# EAGLE design sound (EAGLE 7.2.0)
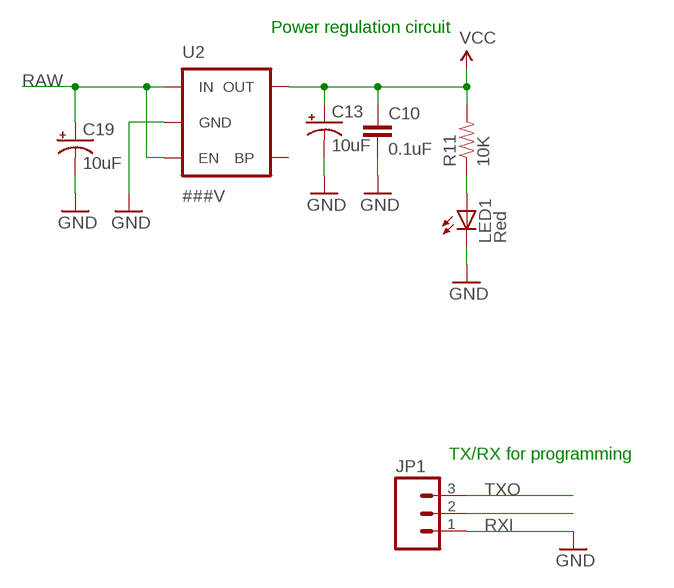
[diagram p0: schematic, sheet 1, part 1 of 2]
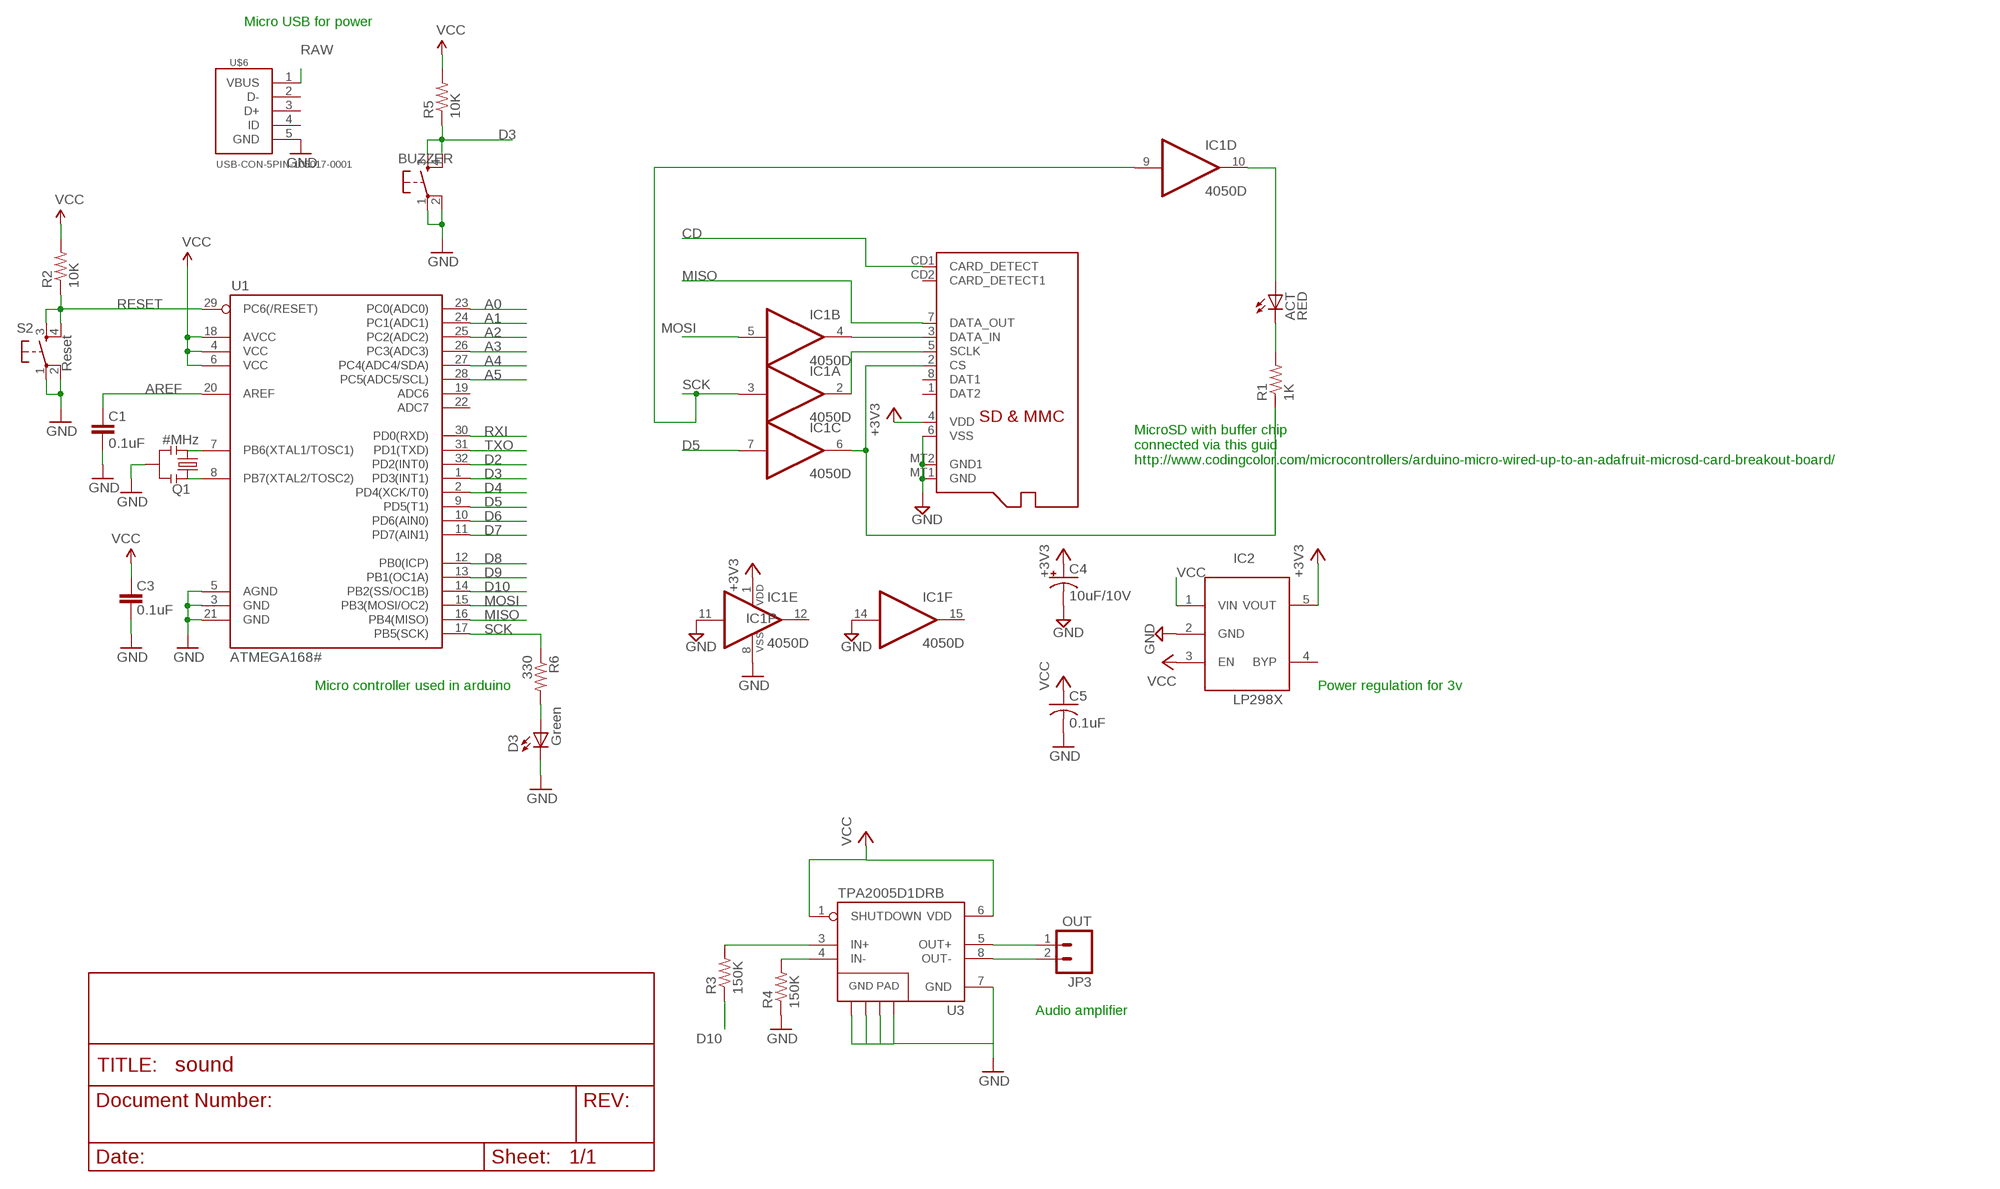
[diagram p1: schematic, sheet 1, part 2 of 2]

## Parts
ACT  RED  LEDCHIP-LED0805  [CHIP-LED0805]
BUZZER  Reset  TAC_SWITCHSND  [TACTILE_SWITCH_SMD]
C1  0.1uF  CAP0402  [C0402]
C3  0.1uF  CAP0402  [C0402]
C4  10uF/10V  CPOL-USA/3216-18R  [A/3216-18R]
C5  0.1uF  C-USC0805K  [C0805K]
C10  0.1uF  CAP0402  [C0402]
C13  10uF  CAP_POL1206  [EIA3216]
C19  10uF  CAP_POL1206  [EIA3216]
D3  Green  LED0603  [LED-0603]
IC1  4050D  [SO16]
IC2  LP298XS  [SOT23-5L]
JP1  M03SMD_RA_MALE  [1X03_SMD_RA_MALE]
JP3  OUT  M02PTH  [1X02]
LED1  Red  LED0603  [LED-0603]
Q1  #MHz  RESONATORSMD  [RESONATOR-SMD]
R1  1K  R-US_R0805  [R0805]
R2  10K  RESISTOR0402  [C0402]
R3  150K  150KOHM1/10W1%(0603)  [0603-RES]
R4  150K  150KOHM1/10W1%(0603)  [0603-RES]
R5  10K  RESISTOR0402  [C0402]
R6  330  RESISTOR0402  [C0402]
R11  10K  RESISTOR0402  [C0402]
S2  Reset  TAC_SWITCHSND  [TACTILE_SWITCH_SMD]
U1  ATMEGA168#  ATMEGA168  [TQFP32-08]
U2  ###V  V_REG_LDOSMD  [SOT23-5]
U3  TPA2005D1DRB  [QFN-8_PAD]
U$6  USB-CON-5PIN-105017-0001  [USB-MICRO-MOLEX-105017-0001]
X1  MICROSD  [MICROSD]

## Nets
+3V3: C4.+ IC1.1(P:VDD) IC2.5(VOUT) X1.4(VDD)
A0: U1.23(PC0(ADC0))
A1: U1.24(PC1(ADC1))
A2: U1.25(PC2(ADC2))
A3: U1.26(PC3(ADC3))
A4: U1.27(PC4(ADC4/SDA))
A5: U1.28(PC5(ADC5/SCL))
AREF: C1.2 U1.20(AREF)
CD: X1.CD1(CARD_DETECT)
D2: U1.32(PD2(INT0))
D3: BUZZER.3 BUZZER.4 R5.1 U1.1(PD3(INT1))
D4: U1.2(PD4(XCK/T0))
D5: IC1.7(C:I) U1.9(PD5(T1))
D6: U1.10(PD6(AIN0))
D7: U1.11(PD7(AIN1))
D8: U1.12(PB0(ICP))
D9: U1.13(PB1(OC1A))
D10: R3.1 U1.14(PB2(SS/OC1B))
GND [vcc]: BUZZER.1 BUZZER.2 C1.1 C3.1 C4.- C5.2 C10.2 C13.C(-) C19.C(-) D3.C IC1.8(P:VSS) IC1.11(E:I) IC1.14(F:I) IC2.2(GND) LED1.C Q1.2 S2.1 S2.2 U1.3(GND) U1.5(AGND) U1.21(GND) U2.2(GND) U3.7(GND) U3.10(GND) U3.11(GND) U3.12(GND) U3.13(GND) X1.6(VSS) X1.MT1(GND) X1.MT2(GND1)
MISO: U1.16(PB4(MISO)) X1.7(DATA_OUT)
MOSI: IC1.5(B:I) U1.15(PB3(MOSI/OC2))
N$1: Q1.1 U1.8(PB7(XTAL2/TOSC2))
N$2: Q1.3 U1.7(PB6(XTAL1/TOSC1))
N$3: ACT.A IC1.10(D:O)
N$4: IC1.2(A:O) X1.5(SCLK)
N$5: IC1.6(C:O) R1.1 X1.2(CS)
N$6: ACT.C R1.2
N$7: D3.A R6.2
N$8: IC1.4(B:O) X1.3(DATA_IN)
N$9: JP3.1 U3.5(OUT+)
N$10: JP3.2 U3.8(OUT-)
N$11: R3.2 U3.3(IN+)
N$12: R4.2 U3.4(IN-)
N$13: JP1.1
N$38: LED1.A R11.1
RAW [vcc]: C19.A(+) U2.1(IN) U2.3(EN)
RESET: R2.1 S2.3 S2.4 U1.29(PC6(/RESET))
RXI: JP1.2 U1.30(PD0(RXD))
SCK: IC1.3(A:I) IC1.9(D:I) R6.1 U1.17(PB5(SCK))
TXO: JP1.3 U1.31(PD1(TXD))
VCC: C3.2 C5.1 C10.1 C13.A(+) IC2.1(VIN) IC2.3(EN) R2.2 R5.2 R11.2 U1.4(VCC) U1.6(VCC) U1.18(AVCC) U2.5(OUT) U3.1(SHUTDOWN) U3.6(VDD)
Unconnected: IC1.12(E:O) IC1.15(F:O) IC2.4(BYP) R4.1 U1.19(ADC6) U1.22(ADC7) U2.4(BP) U$6.2(D-) U$6.3(D+) U$6.4(ID) X1.1(DAT2) X1.8(DAT1) X1.CD2(CARD_DETECT1)

## Notes on the sheet
- Micro USB for power
- Power regulation circuit
- MicroSD with buffer chip
  connected via this guid
  http://www.codingcolor.com/microcontrollers/arduino-micro-wired-up-to-an-adafruit-microsd-card-breakout-board/
- TX/RX for programming
- Micro controller used in arduino | Power regulation for 3v
- Audio amplifier

## Power pins joined to a net without a drawn wire
GND: U$6.5(GND)
VBUS: U$6.1(VBUS)

## Library data of the parts
ACT = adafruit:LED: LED OSRAM: - CHIPLED LG R971, LG N971, LY N971, LG Q971, LY Q971, LO R971, LY R971 LH N974, LH R974 LS Q976, LO Q976, LY Q976 LO Q996 - Hyper CHIPLED LW Q18S LB Q993, LB Q99A, LB R99A - SideLED LS A670, LO A670, LY A670, LG A670, LP A670 LB A673, LV A673, LT A673, LW A673 LH A674 LY A675 LS A676, LA A676, LO A676, LY A676, LW A676 LS A679, LY A679, LG A679 - Hyper Micro SIDELED® LS Y876, LA Y876, LO Y876, LY Y876 LT Y87S - SmartLED LW L88C, LW L88S LB L89C, LB L89S, LG L890 LS L89K, LO L89K, LY L89K LS L896, LA L896, LO L896, LY L896 - TOPLED LS T670, LO T670, LY T670, LG T670, LP T670 LSG T670, LSP T670, LSY T670, LOP T670, LYG T670 LG T671, LOG T671, LSG T671 LB T673, LV T673, LT T673, LW T673 LH T674 LS T676, LA T676, LO T676, LY T676, LB T676, LH T676, LSB T676, LW T676 LB T67C, LV T67C, LT T67C, LS T67K, LO T67K, LY T67K, LW E67C LS E67B, LA E67B, LO E67B, LY E67B, LB E67C, LV E67C, LT E67C LW T67C LS T679, LY T679, LG T679 LS T770, LO T770, LY T770, LG T770, LP T770 LB T773, LV T773, LT T773, LW T773 LH T774 LS E675, LA E675, LY E675, LS T675 LS T776, LA T776, LO T776, LY T776, LB T776 LHGB T686 LT T68C, LB T68C - Hyper Mini TOPLED® LB M676 - Mini TOPLED Santana® LG M470 LS M47K, LO M47K, LY M47K Source: http://www.osram.convergy.de/
BUZZER S2 = SparkFun:TAC_SWITCH: Momentary Switch Button commonly used for reset or general input. Spark Fun Electronics SKU : COM-00097
C1 C3 C10 = SparkFun:CAP: Capacitor Standard 0603 ceramic capacitor, and 0.1" leaded capacitor.
C4 = adafruit:CPOL-US: POLARIZED CAPACITOR, American symbol
C5 = adafruit:C-US: CAPACITOR, American symbol
C13 C19 = SparkFun:CAP_POL: Capacitor Polarized These are standard SMD and PTH capacitors. Normally 10uF, 47uF, and 100uF in electrolytic and tantalum varieties. Always verify the external diameter of the through hole cap, it varies with capacity, voltage, and manufacturer. The EIA devices should be standard.
D3 LED1 = SparkFun:LED: LEDs Standard schematic elements and footprints for 5mm, 3mm, 1206, and 0603 sized LEDs. 5mm - Spark Fun Electronics SKU : COM-00529 (and others)
IC1 = 40xx:4050: Hex non-inverting BUFFER
IC2 = adafruit:LP298X
JP1 = SparkFun-Connectors:M03: Header 3 Standard 3-pin 0.1" header. Use with straight break away headers (SKU : PRT-00116), right angle break away headers (PRT-00553), swiss pins (PRT-00743), machine pins (PRT-00117), and female headers (PRT-00115). Molex polarized connector foot print use with SKU : PRT-08232 with associated crimp pins and housings.; PROD_ID: CONN-10925
JP3 = SparkFun:M02: Header 2 Standard 2-pin 0.1" header. Use with straight break away headers (SKU : PRT-00116), right angle break away headers (PRT-00553), swiss pins (PRT-00743), machine pins (PRT-00117), and female headers (PRT-00115). Molex polarized connector foot print use with SKU : PRT-08233 with associated crimp pins and housings.
Q1 = SparkFun:RESONATOR: Resonator Small SMD resonator. This is the itty bitty 10/20MHz resonators with built in caps. CSTCE10M0G55 and CSTCE20M0V53. Footprint has been reviewed closely but hasn't been tested yet.
R1 = adafruit:R-US_: RESISTOR, American symbol
R2 R5 R6 R11 = SparkFun:RESISTOR: Resistor Basic schematic elements and footprints for 0603, 1206, and PTH 1/10th watt (small) resistors.
R3 R4 = SparkFun-Resistors:150KOHM1/10W1%(0603): RES-09117; PROD_ID: RES-09117
U1 = SparkFun:ATMEGA168
U2 = SparkFun:V_REG_LDO: Voltage Regulator LDO Standard 150mA LDO voltage regulator in SOT-23 layout. Micrel part MIC5205. BP (by-pass) pin is used to lower output noise with 470pF cap.
U3 = mike-temp:TPA2005D1: 1.4W MONO CLASS-D AUDIO POWER AMPLIFIER The TPA2005D1 is a 1.4-W high efficiency filter-free class-D audio power amplifier in a BGA, QFN, or MSOP package that requires only three external components. Datasheet: http://focus.ti.com/lit/ds/symlink/tpa2005d1.pdf 1.4 W Into 8 ? From a 5V Supply at THD = 10% (Typ) Maximum Battery Life and Minimum Heat Efficiency With an 8-? Speaker: 84% at 400 mW, 79% at 100 mW 2.8-mA Quiescent Current 0.5-mA Shutdown Current Ideal for Wireless or Cellular Handsets and PDAs Capable of Driving an 8-? Speaker (2.5 V ? VDD ? 5.5 V) and a 4-? Speaker (2.5 V ? VDD ? 4.2 V) Only Three External Components Optimized PWM Output Stage Eliminates LC Output Filter Internally Generated 250-kHz Switching Frequency Eliminates Capacitor and Resistor Improved PSRR (-71 dB at 217 Hz) and Wide Supply Voltage (2.5 V to 5.5 V) Eliminates Need for a Voltage Regulator Fully Differential Design Reduces RF Rectification and Eliminates Bypass Capacitor Improved CMRR Eliminates Two Input Coupling Capacitors
U$6 = GeekAmmo:USB-CON-5PIN: Molex Micro USB 105017-0001
X1 = adafruit:MICROSD: Micro-SD / Transflash card holder with SPI pinout For the 3M # 2908-05WB-MG and/or 4UCON #19656 push-push type

## Net classes
0 default: clearance 0.254 mm
1 vcc: width 0.254 mm

## Board
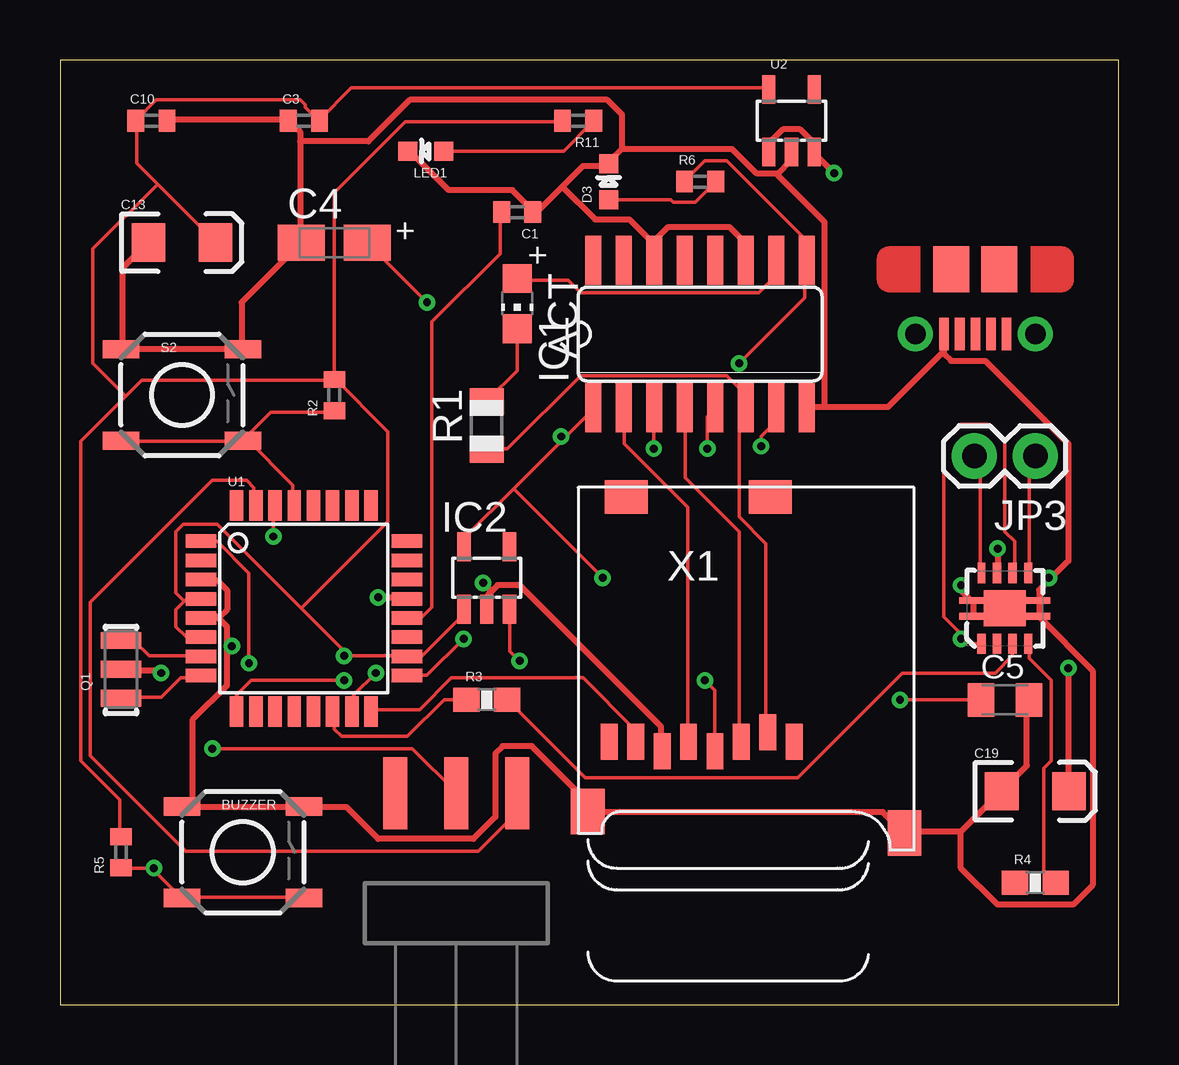
[diagram p2: board, top side]
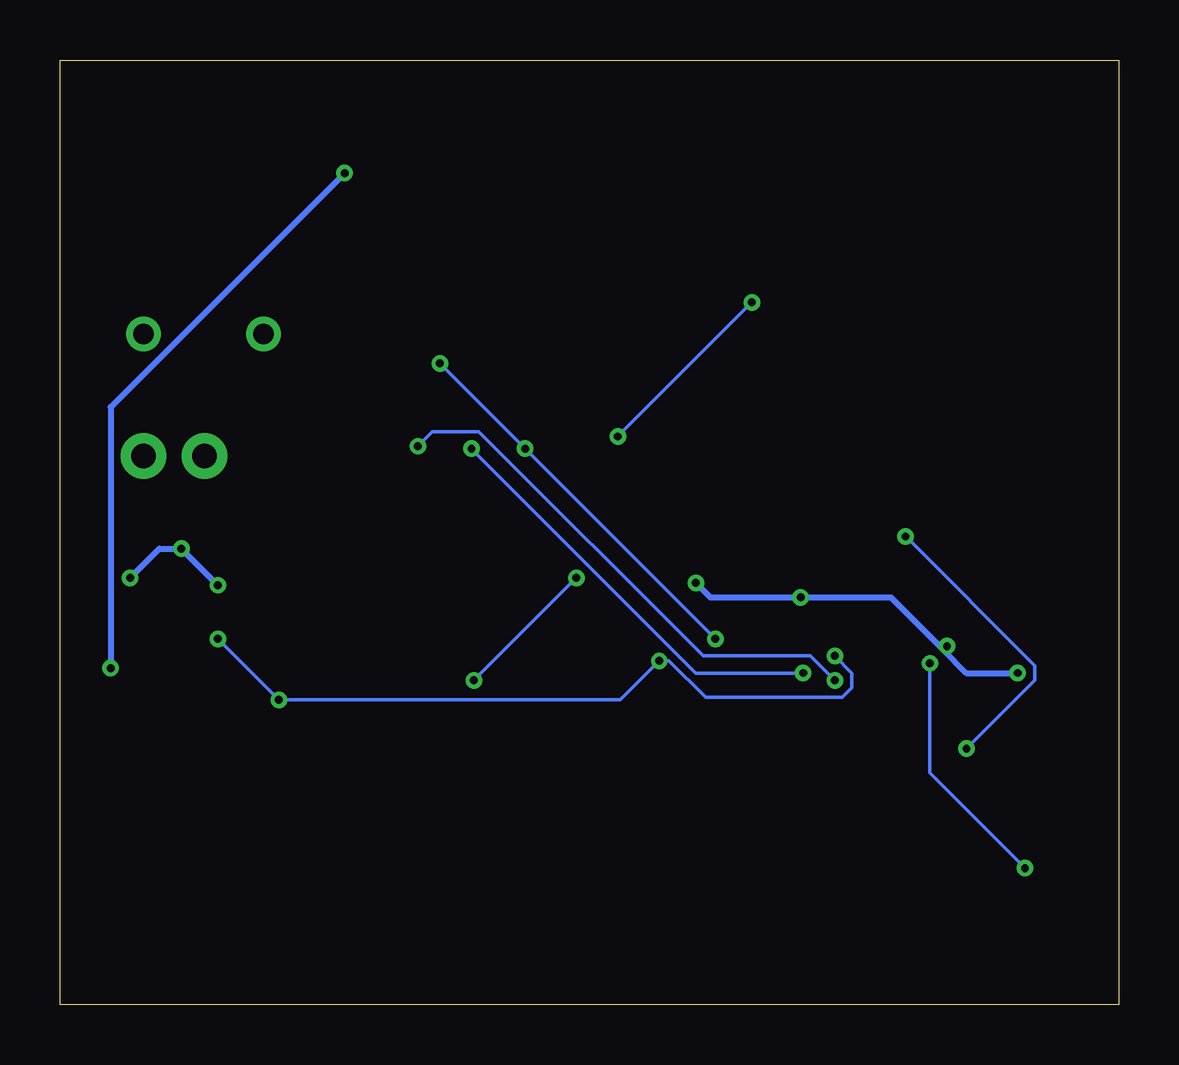
[diagram p3: board, bottom side, seen from below]

Size 44.12 x 39.36 mm. Coordinates in mm from the lower left corner, seen from the top.
Outline: 0,0 44.12,0 44.12,39.36 0,39.36 0,0
Copper layers (1*16): Top 0.0356mm / dielectric 1.5011mm / Bottom 0.0356mm
Design rules "LaenPCBOrder": minimum track width 6mil, minimum drill 13mil, track to track 6mil, track to pad 6mil, pad to pad 6mil, via to via 6mil, smd to smd 6mil, copper to edge 15mil, drill to drill 6mil, minimum pad ring 7mil, minimum via ring 7mil, stop-mask expansion 3mil, vias tented up to drill 0mil, thermal gap 10mil

### Footprints (pad centres in the part's own frame; a part is rotated, then mirrored left to right if it is on the bottom)
CHIP-LED0805 = smd 1.2 x 1.2: A 0,-1.05; C 0,1.05
TACTILE_SWITCH_SMD = smd 1.524 x 0.762: 1 -2.54,1.905; 2 2.54,1.905; 3 -2.54,-1.905; 4 2.54,-1.905
C0402 = smd 0.7 x 0.9: 1 -0.65,0; 2 0.65,0
A/3216-18R = smd 1.95 x 1.5: + 1.375,0; - -1.375,0
C0805K = smd 1.1 x 1.4: 1 -1,0; 2 1,0
EIA3216 = smd 1.4 x 1.6: A 1.4,0; C -1.4,0
LED-0603 = smd 0.8 x 0.8: A 0,-0.75; C 0,0.75
SO16 = smd 0.66 x 2.032: 1 -4.445,-3.073; 2 -3.175,-3.073; 3 -1.905,-3.073; 4 -0.635,-3.073; 5 0.635,-3.073; 6 1.905,-3.073; 7 3.175,-3.073; 8 4.445,-3.073; 9 4.445,3.073; 10 3.175,3.073; 11 1.905,3.073; 12 0.635,3.073; 13 -0.635,3.073; 14 -1.905,3.073; 15 -3.175,3.073; 16 -4.445,3.073
SOT23-5L = smd 0.55 x 1.2: 1 -0.95,-1.3; 2 0,-1.3; 3 0.95,-1.3; 4 0.95,1.3; 5 -0.95,1.3
1X03_SMD_RA_MALE = smd 1 x 3: 1 -2.54,5; 2 0,5; 3 2.54,5
1X02 = drill 1.016 pad 1.88: 1 0,0; 2 2.54,0
RESONATOR-SMD = smd 0.7 x 1.7: 1 -1.2,0; 2 0,0; 3 1.2,0
R0805 = smd 1.1 x 1.4: 1 -1,0; 2 1,0
0603-RES = smd 1.1 x 1: 1 -0.85,0; 2 0.85,0
TQFP32-08 = smd 1.27 x 0.559: 1 -4.293,2.8; 2 -4.293,2; 3 -4.293,1.2; 4 -4.293,0.4; 5 -4.293,-0.4; 6 -4.293,-1.2; 7 -4.293,-2; 8 -4.293,-2.8; 17 4.293,-2.8; 18 4.293,-2; 19 4.293,-1.2; 20 4.293,-0.4; 21 4.293,0.4; 22 4.293,1.2; 23 4.293,2; 24 4.293,2.8 | smd 0.559 x 1.27: 9 -2.8,-4.293; 10 -2,-4.293; 11 -1.2,-4.293; 12 -0.4,-4.293; 13 0.4,-4.293; 14 1.2,-4.293; 15 2,-4.293; 16 2.8,-4.293; 25 2.8,4.293; 26 2,4.293; 27 1.2,4.293; 28 0.4,4.293; 29 -0.4,4.293; 30 -1.2,4.293; 31 -2,4.293; 32 -2.8,4.293
SOT23-5 = smd 0.55 x 1.2: 1 -0.95,-1.3; 2 0,-1.3; 3 0.95,-1.3; 4 0.95,1.3; 5 -0.95,1.3
QFN-8_PAD = smd 0.35 x 0.85: 1 -0.975,-1.475; 2 -0.325,-1.475; 3 0.325,-1.475; 4 0.975,-1.475; 5 0.975,1.475; 6 0.325,1.475; 7 -0.325,1.475; 8 -0.975,1.475 | smd 1.75 x 1.5: 9 0,0 | smd 1.025 x 0.28: 10 -1.387,-0.325; 11 1.387,-0.325; 12 1.387,0.325; 13 -1.387,0.325
USB-MICRO-MOLEX-105017-0001 = smd 0.4 x 1.35: 1 1.2,0; 2 1.85,0; 3 2.5,0; 4 3.15,0; 5 3.8,0 | drill 0.85 pad 1.45: P$1 0,0; P$2 5,0 | smd 1.5 x 1.9: P$3 3.5,-2.7; P$4 1.5,-2.7
MICROSD = smd 0.7 x 1.5: 1 9,-10.64; 2 7.9,-10.24; 3 6.8,-10.64; 4 5.7,-11.04; 5 4.6,-10.64; 6 3.5,-11.04; 7 2.4,-10.64; 8 1.3,-10.64 | smd 1.8 x 1.4: CD1 2,-0.44; CD2 8,-0.44 | smd 1.4 x 1.9: MT1 0.4,-13.54; MT2 13.6,-14.44

### Placement (x,y rotation side)
ACT  19.05,29.21 180 top
BUZZER  7.62,6.35 0 top
C1  19.05,33.02 180 top
C3  10.16,36.83 0 top
C4  11.43,31.75 0 top
C5  39.37,12.7 0 top
C10  3.81,36.83 0 top
C13  5.08,31.75 0 top
C19  40.64,8.89 0 top
D3  22.86,34.29 0 top
IC1  26.67,27.94 0 top
IC2  17.78,17.78 0 top
JP1  16.51,3.81 0 top
JP3  40.64,22.86 180 top
LED1  15.24,35.56 90 top
Q1  2.54,13.97 90 top
R1  17.78,24.13 90 top
R2  11.43,25.4 90 top
R3  17.78,12.7 0 top
R4  40.64,5.08 0 top
R5  2.54,6.35 90 top
R6  26.67,34.29 0 top
R11  21.59,36.83 180 top
S2  5.08,25.4 0 top
U1  10.16,16.51 0 top
U2  30.48,36.83 0 top
U3  39.37,16.51 0 top
U$6  40.64,27.94 180 top
X1  21.59,21.59 0 top

### Tracks (layer width: path | path; a pad name or v marks a point on that pad's centre or on a via)
+3V3  (via drill 0.33)
  Top 0.152: 21.03,23.62 22.2,24.79 IC1.1 | 21.03,23.62 18.9,21.49 | 18.9,21.49 16.92,19.51 16.92,19.1 IC2.5 | v26.87,13.51 27.28,13.11 27.28,10.57 X1.4 | 18.9,21.49 v22.61,17.78 | v15.29,29.26 12.85,31.7 C4.+ | v20.88,23.67 20.98,23.67 21.03,23.62
  Bottom 0.152: v22.61,17.78 v26.87,13.51 | v20.88,23.67 v15.29,29.26
AREF
  Top 0.152: C1.2 18.34,33.02 18.34,31.29 15.49,28.45 15.49,16.56 15.09,16.15 14.48,16.15 U1.20
D3  (via drill 0.33)
  Top 0.152: 3.86,5.64 5.03,4.47 BUZZER.3 5.13,4.47 10.11,4.47 BUZZER.4 | 3.86,5.64 3.81,5.69 2.59,5.69 R5.1 | v7.87,14.22 7.87,17.98 6.55,19.3 5.94,19.3 U1.1 | v3.91,5.69 3.86,5.64
  Bottom 0.152: v7.87,14.22 7.87,9.65 v3.91,5.69
D5  (via drill 0.33)
  Top 0.152: v11.84,13.51 7.98,13.51 7.37,12.9 7.37,12.29 U1.9 | v29.21,23.27 29.21,23.67 29.82,24.28 29.82,24.79 IC1.7
  Bottom 0.152: v11.84,13.51 12.85,14.53 17.32,14.53 26.67,23.88 28.6,23.88 v29.21,23.27
D10
  Top 0.152: R3.1 16,12.7 14.48,11.18 11.73,11.18 11.43,11.48 11.43,12.19 U1.14
GND  (via drill 0.33)
  Top 0.254: 17.98,17.22 18.24,17.47 19.15,17.47 25.04,11.58 25.04,10.57 X1.6 | 17.98,17.22 17.83,17.07 17.83,16.56 IC2.2 | v13.26,16.97 14.38,16.97 U1.21 | 17.98,17.22 v17.63,17.58 | v4.22,13.82 4.12,13.92 2.59,13.92 Q1.2 | 6.65,16.15 5.94,16.15 U1.5 | 6.65,16.15 6.96,16.46 6.96,17.27 6.55,17.68 5.94,17.68 U1.3 | 6.96,14.93 6.96,13.31 5.54,11.89 5.54,8.33 BUZZER.1 5.13,8.23 10.11,8.23 BUZZER.2 10.21,8.23 11.94,8.23 13.26,6.91 17.22,6.91 18.14,7.82 18.14,10.46 18.44,10.77 19.66,10.77 21.89,8.53 21.89,8.13 X1.MT1 22,8.03 34.29,8.03 35.1,7.21 X1.MT2 35.2,7.21 37.54,7.21 | 6.96,14.93 6.96,15.75 6.65,16.05 6.65,16.15 | C5.2 40.28,12.7 40.28,9.96 39.27,8.94 C19.C 39.17,8.84 37.54,7.21 | v7.16,14.93 6.96,14.93 | v39.06,19 39.06,18.08 U3.7 | v37.54,17.47 37.54,17.27 37.95,16.87 U3.13 38.05,16.76 38.05,16.26 U3.10 | 41.25,17.73 42.01,18.49 42.01,23.37 38.56,26.82 37.13,26.82 36.83,27.13 | 41.25,17.73 40.79,17.27 40.79,16.87 U3.12 40.79,16.76 40.79,16.26 U3.11 40.79,16.15 43.03,13.92 43.03,4.98 42.21,4.17 39.06,4.17 37.54,5.69 37.54,7.21 | 36.83,27.13 U$6.5 | 31.85,24.89 34.49,24.89 36.73,27.13 36.83,27.13 | 31.85,24.89 31.14,24.89 IC1.8 | v41.2,17.78 41.25,17.73 | C13.C 3.61,31.7 2.59,30.68 2.59,27.33 S2.1 2.69,27.33 7.57,27.33 S2.2 7.57,27.43 7.57,29.26 10.01,31.7 C4.- 10.01,31.8 10.01,35.97 | C10.2 4.52,36.88 9.5,36.88 C3.1 9.6,36.78 10.01,36.37 10.01,35.97 | LED1.C 14.58,35.56 16.2,33.93 18.85,33.93 19.76,33.02 C1.1 19.86,33.02 20.93,34.09 | 20.93,34.09 21.79,34.95 22.81,34.95 D3.C 22.91,35.15 23.42,35.66 | 29.92,34.65 30.43,35.15 30.43,35.46 U2.2 | 29.92,34.65 29.01,34.65 27.99,35.66 23.42,35.66
  Top 0.254: 20.93,34.09 22.3,32.72 23.72,32.72 24.74,31.7 24.74,31.09 IC1.14 24.74,31.8 25.35,32.41 27.89,32.41 28.5,31.8 28.5,31.09 IC1.11 | 10.01,35.97 12.85,35.97 14.58,37.69 22.81,37.69 23.42,37.08 23.42,35.66 | 31.85,24.89 31.85,32.61 29.92,34.54 29.92,34.65
  Bottom 0.254: v17.63,17.58 17.02,16.97 v13.26,16.97 9.5,16.97 7.31,14.78 | v4.22,13.82 6.35,13.82 7.31,14.78 | v7.16,14.93 7.31,14.78 | v37.54,17.47 v39.06,19 39.98,19 v41.2,17.78
MISO
  Top 0.152: U1.16 13.06,12.29 14.99,12.29 16.31,13.61 21.79,13.61 23.93,11.48 23.93,10.97 X1.7
MOSI  (via drill 0.33)
  Top 0.152: v13.16,13.82 12.24,12.9 12.24,12.29 U1.15 | v26.98,23.16 26.98,24.49 27.28,24.79 IC1.5
  Bottom 0.152: v13.16,13.82 17.63,13.82 v26.98,23.16
N$1
  Top 0.152: U1.8 5.84,13.61 5.03,13.61 4.22,12.8 2.59,12.8 Q1.1
N$2
  Top 0.152: U1.7 5.84,14.53 3.71,14.53 3.1,15.14 2.59,15.14 Q1.3
N$3
  Top 0.152: ACT.A 19.05,30.18 21.18,30.18 21.69,29.67 29.11,29.67 29.82,30.38 29.82,30.99 IC1.10
N$4
  Top 0.152: X1.5 26.16,10.97 26.16,20.73 23.52,23.37 23.52,24.79 IC1.2
N$5
  Top 0.152: R1.1 17.83,23.16 18.64,23.16 21.69,26.21 27.79,26.21 28.5,25.5 28.5,24.89 IC1.6 28.3,24.59 28.3,20.32 29.41,19.2 29.41,11.38 X1.2
N$6
  Top 0.152: ACT.C 19.05,26.42 17.83,25.2 R1.2
N$7
  Top 0.152: D3.A 22.91,33.53 25.45,33.53 25.55,33.43 26.47,33.43 27.28,34.24 R6.2
N$8
  Top 0.152: X1.3 28.3,10.97 28.3,19.71 26.06,21.95 26.06,24.79 IC1.4
N$9
  Top 0.152: U3.5 40.39,18.08 40.39,22.66 40.59,22.86 JP3.1
N$10
  Top 0.152: U3.8 38.35,18.08 38.35,22.66 38.15,22.86 JP3.2
N$11
  Top 0.152: U3.3 39.67,14.93 39.67,14.53 38.96,13.82 35.1,13.82 30.73,9.45 21.89,9.45 18.64,12.7 R3.2
N$12
  Top 0.152: U3.4 40.39,14.93 40.39,14.43 41.3,13.51 41.3,10.16 41,9.86 41,5.49 41.4,5.08 R4.2
N$38
  Top 0.152: LED1.A 20.98,35.56 22.2,36.78 R11.1
RAW  (via drill 0.33)
  Top 0.254: U2.1 29.62,35.56 29.62,35.97 30.12,36.47 30.84,36.47 31.34,35.97 31.34,35.56 U2.3 31.45,35.46 v32.26,34.65 | v42.01,14.02 42.01,8.94 C19.A
  Bottom 0.254: v42.01,14.02 42.01,24.89 v32.26,34.65
RESET
  Top 0.152: R2.1 11.43,24.69 8.79,24.69 7.67,23.57 S2.4 | U1.29 9.7,20.83 9.7,21.64 7.77,23.57 S2.4 | S2.3 2.59,23.47 7.57,23.47 S2.4
RXI  (via drill 0.33)
  Top 0.152: v8.89,19.51 8.89,20.73 U1.30 | v6.35,10.67 14.68,10.67 16.51,8.84 JP1.2
  Bottom 0.152: v8.89,19.51 3.5,14.12 3.5,13.51 v6.35,10.67
SCK  (via drill 0.33)
  Top 0.152: R6.1 26.06,34.34 26.87,35.15 27.79,35.15 31.04,31.9 31.04,31.09 IC1.9 31.04,30.99 31.04,29.46 v28.3,26.72 | v16.81,15.24 15.29,13.72 14.48,13.72 U1.17 | v24.74,23.16 24.74,24.79 IC1.3
  Bottom 0.152: v16.81,15.24 v24.74,23.16 v28.3,26.72
TXO
  Top 0.152: JP1.3 19.05,8.03 17.42,6.4 5.23,6.4 1.27,10.36 1.27,16.76 6.35,21.84 7.77,21.84 8.08,21.54 8.08,20.83 U1.31
VCC  (via drill 0.33)
  Top 0.152: 37.59,15.39 36.83,16.15 36.83,23.47 37.54,24.18 38.66,24.18 39.37,23.47 39.37,19.71 39.78,19.3 39.78,18.08 U3.6 | 37.59,15.39 37.95,15.04 38.35,15.04 U3.1 | 5.18,16.81 5.23,16.87 5.84,16.87 U1.4 | 5.18,16.81 4.83,16.46 4.83,15.75 5.23,15.34 5.84,15.34 U1.6 | IC2.1 16.81,16.46 16.81,16.26 15.09,14.53 14.48,14.53 U1.18 14.38,14.53 12.04,14.53 | v19.15,14.33 18.75,14.73 18.75,16.46 IC2.3 | v35,12.7 C5.1 | 5.18,16.81 4.83,17.17 4.83,19.71 5.13,20.02 6.55,20.02 10.06,16.51 | 12.04,14.53 10.06,16.51 | 12.04,14.53 v11.84,14.53 | v37.54,15.24 37.54,15.34 37.59,15.39 | 4.06,34.19 6.45,31.8 C13.A | 4.06,34.19 3.2,35.05 3.2,36.78 C10.1 3.2,36.88 4.01,37.69 10.01,37.69 10.21,37.49 10.21,37.39 10.72,36.88 C3.2 10.82,36.88 12.14,38.2 29.52,38.2 U2.5 | 2.74,25.35 3.4,26.01 11.43,26.01 R2.2 11.43,26.11 | 2.74,25.35 0.86,23.47 0.86,10.16 2.49,8.53 2.49,7.01 R5.2 | 11.43,26.11 11.43,33.83 14.38,36.78 20.88,36.78 R11.2 | 4.06,34.19 1.37,31.5 1.37,26.72 2.74,25.35 | 10.06,16.51 13.66,20.12 13.66,23.88 11.43,26.11
  Bottom 0.152: v11.84,14.53 11.12,13.82 11.12,13.21 11.53,12.8 17.22,12.8 18.75,14.33 v19.15,14.33 20.78,12.7 v35,12.7 v37.54,15.24